# Altium schematic sheet 18 I2S.SchDoc
size 420 x 297 mm; Address1: Address1; Address2: Address2; Address3: Address3; Address4: Address4; DocumentNumber: АБВГ.123456.001 Э3; SheetNumber: 18; SheetTotal: 23; Scale: 1:1; DocumentType: Схема электрическая принципиальная; FirstReferrence: АБВГ.123456.001
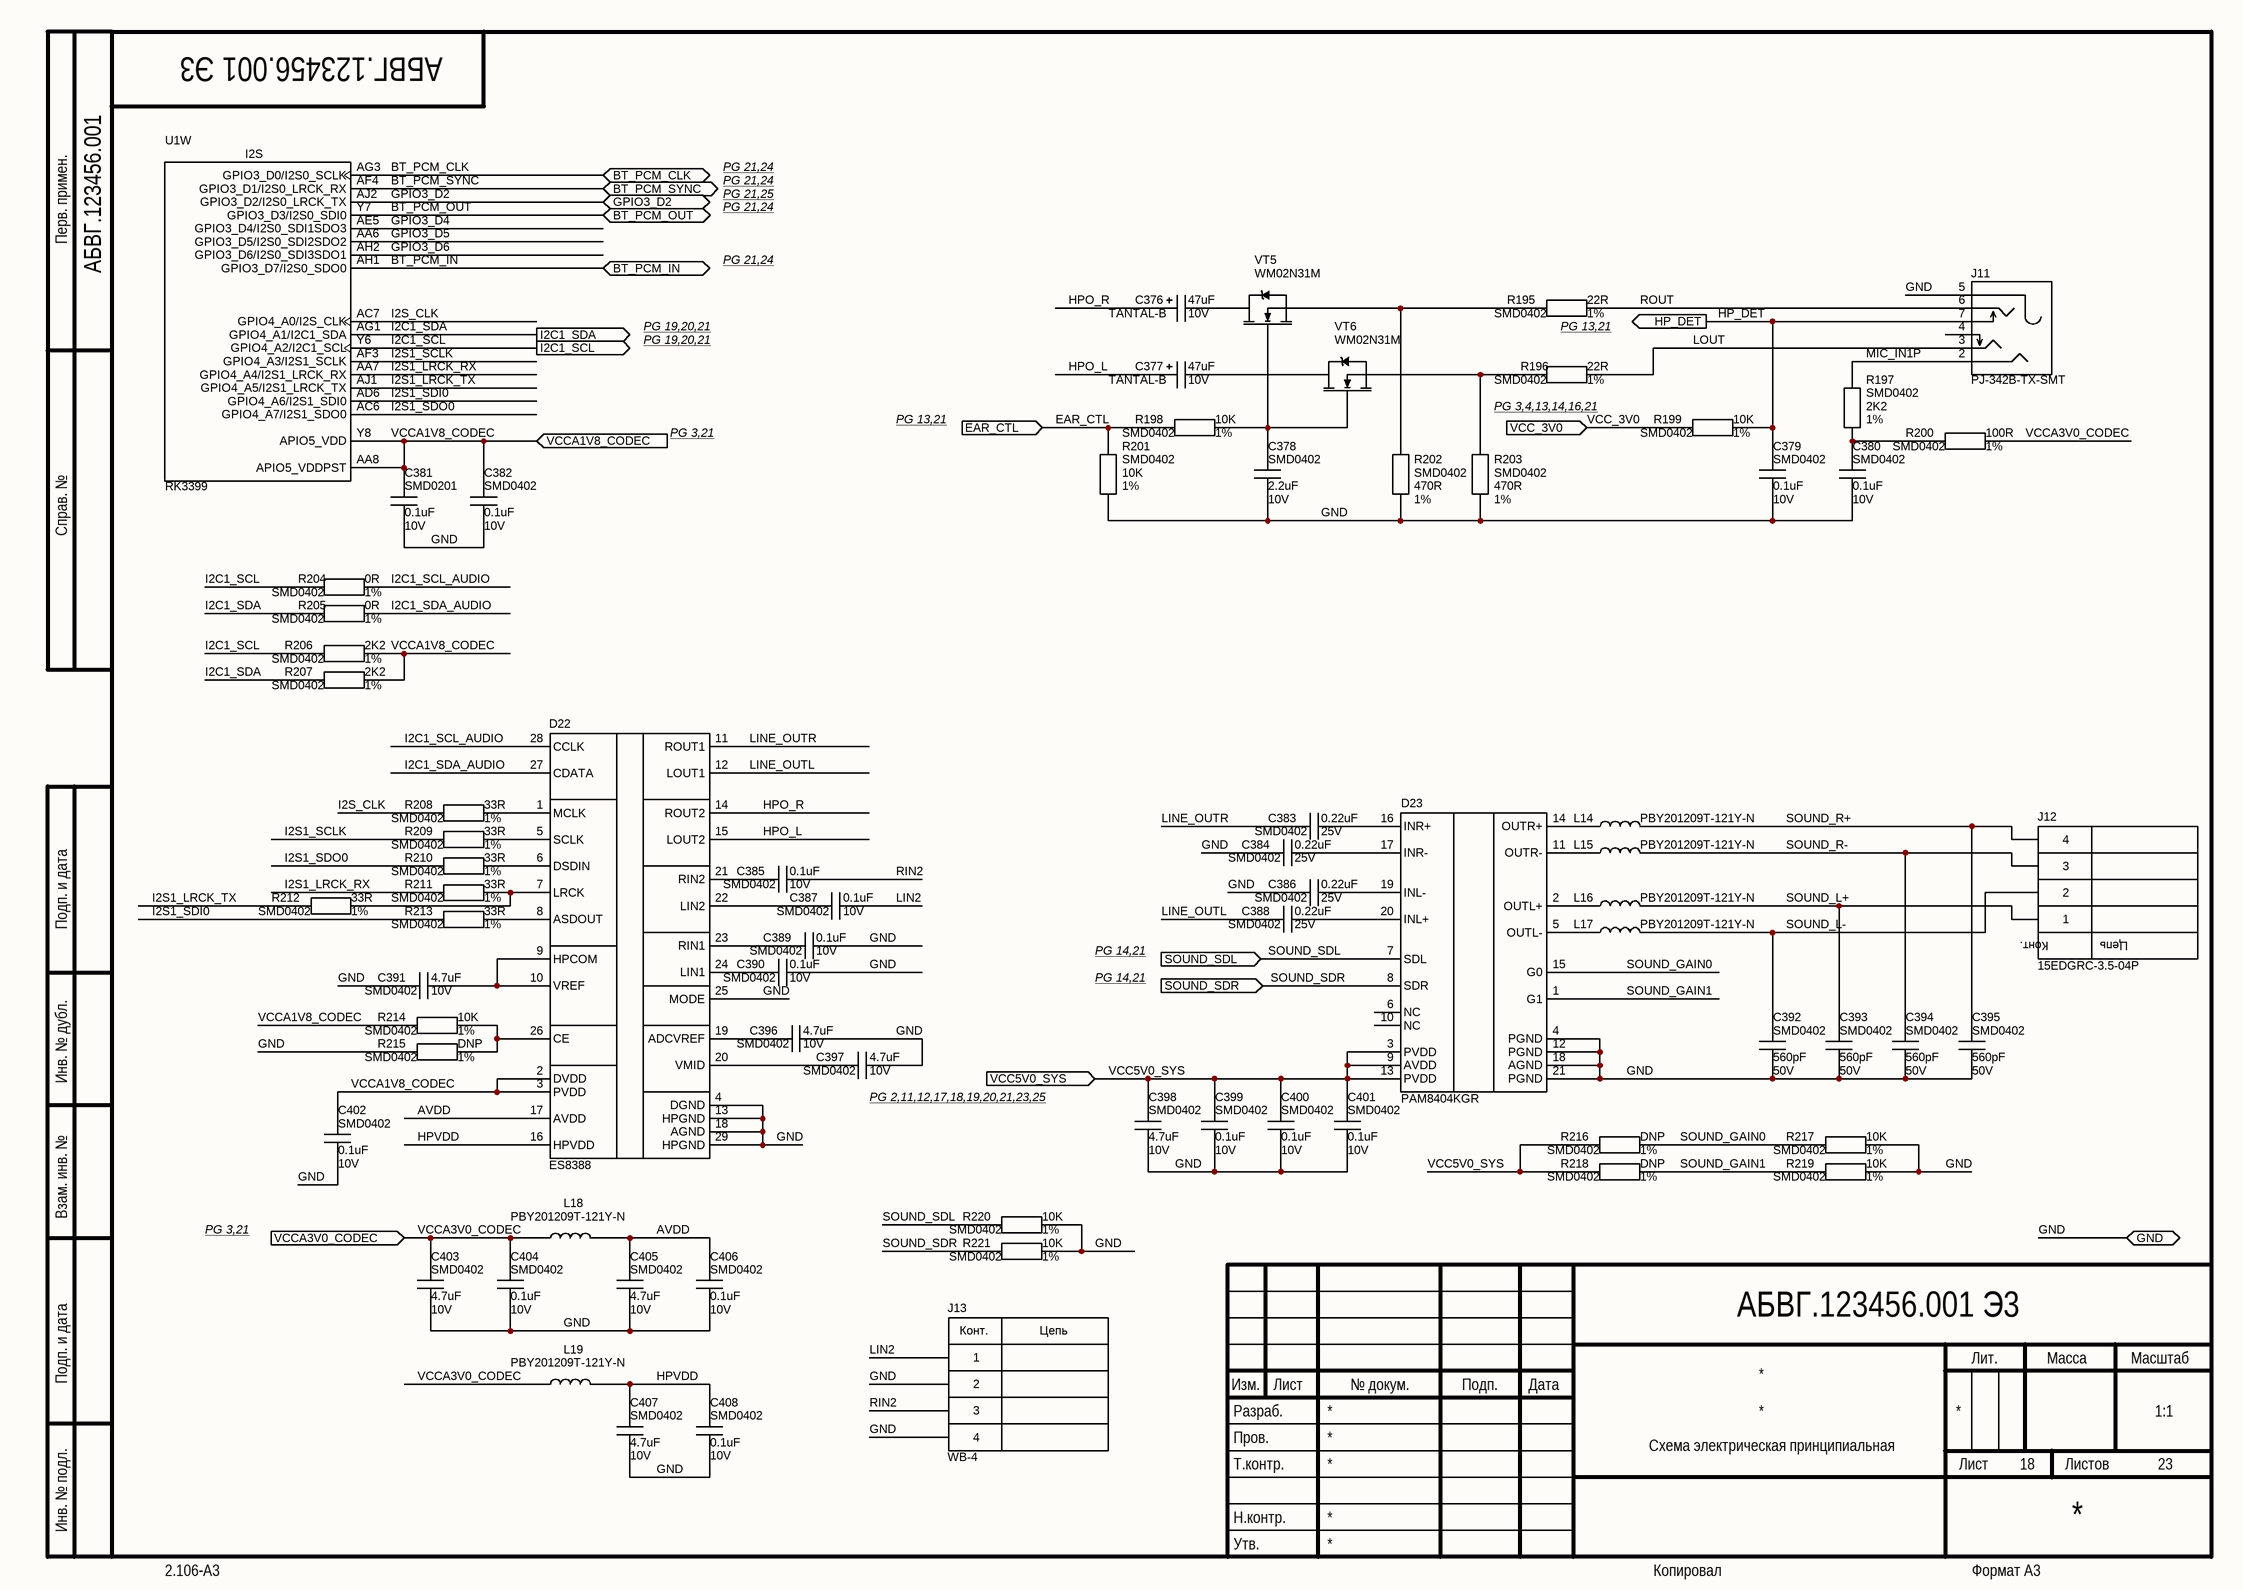
[diagram p0: 18 I2S.SchDoc]

## Parts
C376  Voltage: 10V  [TANTAL-B]  (hidden comment: 47uF)
C377  Voltage: 10V  [TANTAL-B]  (hidden comment: 47uF)
C378  Package: SMD0402  Voltage: 10V  [CAP_SMD_0402]  (hidden comment: 2.2uF)
C379  Package: SMD0402  Voltage: 10V  [CAP_SMD_0402]  (hidden comment: 0.1uF)
C380  Package: SMD0402  Voltage: 10V  [CAP_SMD_0402]  (hidden comment: 0.1uF)
C381  Package: SMD0201  Voltage: 10V  [CAP_SMD_0201]  (hidden comment: 0.1uF)
C382  Package: SMD0402  Voltage: 10V  [CAP_SMD_0402]  (hidden comment: 0.1uF)
C383  Package: SMD0402  Voltage: 25V  [CAP_SMD_0402]  (hidden comment: 0.22uF)
C384  Package: SMD0402  Voltage: 25V  [CAP_SMD_0402]  (hidden comment: 0.22uF)
C385  Package: SMD0402  Voltage: 10V  [CAP_SMD_0402]  (hidden comment: 0.1uF)
C386  Package: SMD0402  Voltage: 25V  [CAP_SMD_0402]  (hidden comment: 0.22uF)
C387  Package: SMD0402  Voltage: 10V  [CAP_SMD_0402]  (hidden comment: 0.1uF)
C388  Package: SMD0402  Voltage: 25V  [CAP_SMD_0402]  (hidden comment: 0.22uF)
C389  Package: SMD0402  Voltage: 10V  [CAP_SMD_0402]  (hidden comment: 0.1uF)
C390  Package: SMD0402  Voltage: 10V  [CAP_SMD_0402]  (hidden comment: 0.1uF)
C391  Package: SMD0402  Voltage: 10V  [CAP_SMD_0402]  (hidden comment: 4.7uF)
C392  Package: SMD0402  Voltage: 50V  [CAP_SMD_0402]  (hidden comment: 560pF)
C393  Package: SMD0402  Voltage: 50V  [CAP_SMD_0402]  (hidden comment: 560pF)
C394  Package: SMD0402  Voltage: 50V  [CAP_SMD_0402]  (hidden comment: 560pF)
C395  Package: SMD0402  Voltage: 50V  [CAP_SMD_0402]  (hidden comment: 560pF)
C396  Package: SMD0402  Voltage: 10V  [CAP_SMD_0402]  (hidden comment: 4.7uF)
C397  Package: SMD0402  Voltage: 10V  [CAP_SMD_0402]  (hidden comment: 4.7uF)
C398  Package: SMD0402  Voltage: 10V  [CAP_SMD_0402]  (hidden comment: 4.7uF)
C399  Package: SMD0402  Voltage: 10V  [CAP_SMD_0402]  (hidden comment: 0.1uF)
C400  Package: SMD0402  Voltage: 10V  [CAP_SMD_0402]  (hidden comment: 0.1uF)
C401  Package: SMD0402  Voltage: 10V  [CAP_SMD_0402]  (hidden comment: 0.1uF)
C402  Package: SMD0402  Voltage: 10V  [CAP_SMD_0402]  (hidden comment: 0.1uF)
C403  Package: SMD0402  Voltage: 10V  [CAP_SMD_0402]  (hidden comment: 4.7uF)
C404  Package: SMD0402  Voltage: 10V  [CAP_SMD_0402]  (hidden comment: 0.1uF)
C405  Package: SMD0402  Voltage: 10V  [CAP_SMD_0402]  (hidden comment: 4.7uF)
C406  Package: SMD0402  Voltage: 10V  [CAP_SMD_0402]  (hidden comment: 0.1uF)
C407  Package: SMD0402  Voltage: 10V  [CAP_SMD_0402]  (hidden comment: 4.7uF)
C408  Package: SMD0402  Voltage: 10V  [CAP_SMD_0402]  (hidden comment: 0.1uF)
D22  ES8388  [QFN-28 4mmx4mm]
D23  PAM8404KGR  [QFN-20 4mmx4mm]
J11  PJ-342B-TX-SMT  [PJ-342B-TX-SMT]
J12  15EDGRC-3.5-04P  [15EDGRC-3.5-04P]
J13  WB-4  [WB-4]
L14  value PBY201209T-121Y-N  [IND_SMD_0805]  (hidden comment: Value)
L15  value PBY201209T-121Y-N  [IND_SMD_0805]  (hidden comment: Value)
L16  value PBY201209T-121Y-N  [IND_SMD_0805]  (hidden comment: Value)
L17  value PBY201209T-121Y-N  [IND_SMD_0805]  (hidden comment: Value)
L18  value PBY201209T-121Y-N  [IND_SMD_0805]  (hidden comment: Value)
L19  value PBY201209T-121Y-N  [IND_SMD_0805]  (hidden comment: Value)
R195  Package: SMD0402  Tolerance: 1%  [RES_SMD_0402]  (hidden comment: 22R)
R196  Package: SMD0402  Tolerance: 1%  [RES_SMD_0402]  (hidden comment: 22R)
R197  Package: SMD0402  Tolerance: 1%  [RES_SMD_0402]  (hidden comment: 2K2)
R198  Package: SMD0402  Tolerance: 1%  [RES_SMD_0402]  (hidden comment: 10K)
R199  Package: SMD0402  Tolerance: 1%  [RES_SMD_0402]  (hidden comment: 10K)
R200  Package: SMD0402  Tolerance: 1%  [RES_SMD_0402]  (hidden comment: 100R)
R201  Package: SMD0402  Tolerance: 1%  [RES_SMD_0402]  (hidden comment: 10K)
R202  Package: SMD0402  Tolerance: 1%  [RES_SMD_0402]  (hidden comment: 470R)
R203  Package: SMD0402  Tolerance: 1%  [RES_SMD_0402]  (hidden comment: 470R)
R204  Package: SMD0402  Tolerance: 1%  [RES_SMD_0402]  (hidden comment: 0R)
R205  Package: SMD0402  Tolerance: 1%  [RES_SMD_0402]  (hidden comment: 0R)
R206  Package: SMD0402  Tolerance: 1%  [RES_SMD_0402]  (hidden comment: 2K2)
R207  Package: SMD0402  Tolerance: 1%  [RES_SMD_0402]  (hidden comment: 2K2)
R208  Package: SMD0402  Tolerance: 1%  [RES_SMD_0402]  (hidden comment: 33R)
R209  Package: SMD0402  Tolerance: 1%  [RES_SMD_0402]  (hidden comment: 33R)
R210  Package: SMD0402  Tolerance: 1%  [RES_SMD_0402]  (hidden comment: 33R)
R211  Package: SMD0402  Tolerance: 1%  [RES_SMD_0402]  (hidden comment: 33R)
R212  Package: SMD0402  Tolerance: 1%  [RES_SMD_0402]  (hidden comment: 33R)
R213  Package: SMD0402  Tolerance: 1%  [RES_SMD_0402]  (hidden comment: 33R)
R214  Package: SMD0402  Tolerance: 1%  [RES_SMD_0402]  (hidden comment: 10K)
R215  Package: SMD0402  Tolerance: 1%  [RES_SMD_0402]  (hidden comment: DNP)
R216  Package: SMD0402  Tolerance: 1%  [RES_SMD_0402]  (hidden comment: DNP)
R217  Package: SMD0402  Tolerance: 1%  [RES_SMD_0402]  (hidden comment: 10K)
R218  Package: SMD0402  Tolerance: 1%  [RES_SMD_0402]  (hidden comment: DNP)
R219  Package: SMD0402  Tolerance: 1%  [RES_SMD_0402]  (hidden comment: 10K)
R220  Package: SMD0402  Tolerance: 1%  [RES_SMD_0402]  (hidden comment: 10K)
R221  Package: SMD0402  Tolerance: 1%  [RES_SMD_0402]  (hidden comment: 10K)
U1  value RK3399  [BGA828C65P31X31_2100X2100X161N]  (hidden comment: RK3399_FF)  (part W of 23)
VT5  value WM02N31M  [SOT23]  (hidden comment: Value)
VT6  value WM02N31M  [SOT23]  (hidden comment: Value)

## Ports
BT_PCM_CLK (bidir), BT_PCM_IN (bidir), BT_PCM_OUT (bidir), BT_PCM_SYNC (bidir), EAR_CTL (in), GND (bidir), GPIO3_D2 (bidir), HP_DET (out), I2C1_SCL (out), I2C1_SDA (out), SOUND_SDL (in), SOUND_SDR (in), VCC5V0_SYS (in), VCC_3V0 (in), VCCA1V8_CODEC (in), VCCA3V0_CODEC (in)

## Nets
AVDD: C405.2 C406.1 D22.17(AVDD) L18.1
BT_PCM_CLK: U1.AG3(GPIO3_D0/I2S0_SCLK) ; port BT_PCM_CLK
BT_PCM_IN: U1.AH1(GPIO3_D7/I2S0_SDO0) ; port BT_PCM_IN
BT_PCM_OUT: U1.Y7(GPIO3_D3/I2S0_SDI0) ; port BT_PCM_OUT
BT_PCM_SYNC: U1.AF4(GPIO3_D1/I2S0_LRCK_RX) ; port BT_PCM_SYNC
EAR_CTL: R198.2 R201.1 ; port EAR_CTL
GND: C378.1 C379.2 C380.2 C381.2 C382.2 C384.2 C386.2 C389.2 C390.2 C391.1 C392.2 C393.2 C394.2 C395.2 C396.2 C397.2 C398.1 C399.2 C400.2 C401.2 C402.2 C403.1 C404.2 C405.1 C406.2 C407.1 C408.2 D22.4(DGND) D22.13(HPGND) D22.18(AGND) D22.25(MODE) D22.29(HPGND) D23.4(PGND) D23.12(PGND) D23.18(AGND) D23.21(PGND) J11.5 J13.2 J13.4 R201.2 R202.1 R203.1 R215.1 R217.1 R219.1 R220.1 R221.1 ; port GND
GPIO3_D2: U1.AJ2(GPIO3_D2/I2S0_LRCK_TX) ; port GPIO3_D2
GPIO3_D4: U1.AE5(GPIO3_D4/I2S0_SDI1SDO3)
GPIO3_D5: U1.AA6(GPIO3_D5/I2S0_SDI2SDO2)
GPIO3_D6: U1.AH2(GPIO3_D6/I2S0_SDI3SDO1)
HP_DET: C379.1 J11.7 R199.1 ; port HP_DET
HPO_L: C377.1 D22.15(LOUT2)
HPO_R: C376.1 D22.14(ROUT2)
HPVDD: C407.2 C408.1 D22.16(HPVDD) L19.1
I2C1_SCL: R204.1 R206.2 U1.Y6(GPIO4_A2/I2C1_SCL) ; port I2C1_SCL
I2C1_SCL_AUDIO: D22.28(CCLK) R204.2
I2C1_SDA: R205.1 R207.2 U1.AG1(GPIO4_A1/I2C1_SDA) ; port I2C1_SDA
I2C1_SDA_AUDIO: D22.27(CDATA) R205.2
I2S1_LRCK_RX: R211.1 U1.AA7(GPIO4_A4/I2S1_LRCK_RX)
I2S1_LRCK_TX: R212.1 U1.AJ1(GPIO4_A5/I2S1_LRCK_TX)
I2S1_SCLK: R209.1 U1.AF3(GPIO4_A3/I2S1_SCLK)
I2S1_SDI0: R213.1 U1.AD6(GPIO4_A6/I2S1_SDI0)
I2S1_SDO0: R210.1 U1.AC6(GPIO4_A7/I2S1_SDO0)
I2S_CLK: R208.1 U1.AC7(GPIO4_A0/I2S_CLK)
LIN2: C387.2 J13.1
LINE_OUTL: C388.2 D22.12(LOUT1)
LINE_OUTR: C383.2 D22.11(ROUT1)
LOUT: J11.3 R196.1
MIC_IN1P: J11.2 R197.2
RIN2: C385.2 J13.3
ROUT: J11.6 R195.1
SOUND_GAIN0: D23.15(G0) R216.2 R217.2
SOUND_GAIN1: D23.1(G1) R218.2 R219.2
SOUND_L+: C393.1 J12.1 L16.1
SOUND_L-: C392.1 J12.2 L17.1
SOUND_R+: C395.1 J12.4 L14.1
SOUND_R-: C394.1 J12.3 L15.1
SOUND_SDL: D23.7(SDL) R220.2 ; port SOUND_SDL
SOUND_SDR: D23.8(SDR) R221.2 ; port SOUND_SDR
VCC5V0_SYS: C398.2 C399.1 C400.1 C401.1 D23.3(PVDD) D23.9(AVDD) D23.13(PVDD) R216.1 R218.1 ; port VCC5V0_SYS
VCC_3V0: R199.2 ; port VCC_3V0
VCCA1V8_CODEC: C381.1 C382.1 C402.1 D22.2(DVDD) D22.3(PVDD) R206.1 R207.1 R214.2 U1.AA8(APIO5_VDDPST) U1.Y8(APIO5_VDD) ; port VCCA1V8_CODEC
VCCA3V0_CODEC: C403.2 C404.1 L18.2 L19.2 R200.2 ; port VCCA3V0_CODEC
NetC376_2: C376.2 VT5.3(D)
NetC377_2: C377.2 VT6.3(D)
NetC378_2: C378.2 R198.1 VT5.1(G) VT6.1(G)
NetC380_1: C380.1 R197.1 R200.1
NetC383_1: C383.1 D23.16(INR+)
NetC384_1: C384.1 D23.17(INR-)
NetC385_1: C385.1 D22.21(RIN2)
NetC386_1: C386.1 D23.19(INL-)
NetC387_1: C387.1 D22.22(LIN2)
NetC388_1: C388.1 D23.20(INL+)
NetC389_1: C389.1 D22.23(RIN1)
NetC390_1: C390.1 D22.24(LIN1)
NetC391_2: C391.2 D22.9(HPCOM) D22.10(VREF)
NetC396_1: C396.1 D22.19(ADCVREF)
NetC397_1: C397.1 D22.20(VMID)
NetD22_1: D22.1(MCLK) R208.2
NetD22_5: D22.5(SCLK) R209.2
NetD22_6: D22.6(DSDIN) R210.2
NetD22_7: D22.7(LRCK) R211.2 R212.2
NetD22_8: D22.8(ASDOUT) R213.2
NetD22_26: D22.26(CE) R214.1 R215.2
NetD23_2: D23.2(OUTL+) L16.2
NetD23_5: D23.5(OUTL-) L17.2
NetD23_11: D23.11(OUTR-) L15.2
NetD23_14: D23.14(OUTR+) L14.2
NetR195_2: R195.2 R202.2 VT5.2(S)
NetR196_2: R196.2 R203.2 VT6.2(S)

Not connected (* = marked no-connect by the designer): D23 6(NC) 10(NC); J11 4

## Notes on the sheet
- PG 21,24
- Перв. примен.
- PG 21,25
- PG 19,20,21
- (near R195) PG 13,21
- PG 3,21
- PG 13,21
- PG 3,4,13,14,16,21
- Справ. №
- Подп. и дата
- PG 14,21
- Инв. № дубл.
- (near C397) PG 2,11,12,17,18,19,20,21,23,25
- Взам. инв. №
- Разраб.
- Изм.
- Лист
- № докум.
- Подп.
- Дата
- Лит.
- Масса
- Масштаб
- Пров.
- Т.контр.
- Листов
- Инв. № подл.
- Утв.
- Н.контр.
- 2.106-A3
- Копировал
- Формат А3
- (in symbol CON4) Конт.; Цепь
- (in symbol RK3399_FF, part W) I2S

## Library data of the parts
C376 C377 = Tantal: PartNumber: CA45L-B010K476TE500; Tolerance: 20%; Manufacturer: *; ComponentType: SMD Tantalum Chip Capacitor; ClassName: *; Package: TANTAL-B; Value: 47uF
C378 = Ceramic_Cap: PartNumber: CC0402KRX5R6BB225; ComponentType: SMD Ceramic Chip Capacitor; Manufacter: *; Tolerance: *; ClassName: *; Value: 2.2uF
C379 C380 C382 C385 C387 C389 C390 C399-C402 C404 C406 C408 = Ceramic_Cap: PartNumber: CC0402KRX5R6BB104; ComponentType: SMD Ceramic Chip Capacitor; Manufacter: *; Tolerance: *; ClassName: *; Value: 0.1uF
C381 = Ceramic_Cap: PartNumber: CC0201KRX5R6BB104; ComponentType: SMD Ceramic Chip Capacitor; Manufacter: *; Tolerance: *; ClassName: *; Value: 0.1uF
C383 C384 C386 C388 = Ceramic_Cap: PartNumber: CC0402KRX5R8BB224; ComponentType: SMD Ceramic Chip Capacitor; Manufacter: *; Tolerance: *; ClassName: *; Value: 0.22uF
C391 C396-C398 C403 C405 C407 = Ceramic_Cap: PartNumber: CL05A475KP5NRNC; ComponentType: SMD Ceramic Chip Capacitor; Manufacter: *; Tolerance: *; ClassName: *; Value: 4.7uF
C392-C395 = Ceramic_Cap: PartNumber: CC0402JRX7R9BB561; ComponentType: SMD Ceramic Chip Capacitor; Manufacter: *; Tolerance: *; ClassName: *; Value: 560pF
J12 = CON4: Manufacter: *; Package: 15EDGRC-3.5-04P; PartNumber: 15EDGRC-3.5-04P; ClassName: *; Value: 15EDGRC-3.5-04P
J13 = CON4: PartNumber: DS1066-04M(MW-4M); Manufacter: *; Package: WB-4; ClassName: *; Value: WB-4
L14-L19 = Inductor_smal: ComponentType: *; Manufacter: *; Package: SMD0805; PartNumber: PBY201209T-121Y-N; ClassName: *
R195 R196 = Chip_Res: PartNumber: RC0402FR-0722RL; ComponentType: SMD Chip Resistor; Manufacter: *; Voltage: *; ClassName: *; Value: 22R
R197 R206 R207 = Chip_Res: PartNumber: RC0402FR-072K2L; ComponentType: SMD Chip Resistor; Manufacter: *; Voltage: *; ClassName: *; Value: 2K2
R198 R199 R201 R214 R217 R219-R221 = Chip_Res: PartNumber: RC0402FR-0710KL; ComponentType: SMD Chip Resistor; Manufacter: *; Voltage: *; ClassName: *; Value: 10K
R200 = Chip_Res: PartNumber: RC0402FR-07100RL; ComponentType: SMD Chip Resistor; Manufacter: *; Voltage: *; ClassName: *; Value: 100R
R202 R203 = Chip_Res: PartNumber: RC0402FR-07470RL; ComponentType: SMD Chip Resistor; Manufacter: *; Voltage: *; ClassName: *; Value: 470R
R204 R205 = Chip_Res: PartNumber: RC0402FR-070RL; ComponentType: SMD Chip Resistor; Manufacter: *; Voltage: *; ClassName: *; Value: 0R
R208-R213 = Chip_Res: PartNumber: RC0402FR-0733RL; ComponentType: SMD Chip Resistor; Manufacter: *; Voltage: *; ClassName: *; Value: 33R
R215 R216 R218 = Chip_Res: PartNumber: Do Not Place; ComponentType: SMD Chip Resistor; Manufacter: *; Voltage: *; ClassName: *; Value: DNP
VT5 VT6 = MOSFET_N: ComponentType: *; Manufacter: *; Package: SOT23; PartNumber: WM02N31M; ClassName: *
D22 = ES8388: ComponentType: SMD Chip Resistor; Manufacter: *; Voltage: *; ClassName: *; Tolerance: *; PartNumber: ES8388; Package: QFN-28; Value: ES8388
D23 = PAM8404KGR: ComponentType: SMD Chip Resistor; Manufacter: *; Voltage: *; ClassName: *; Tolerance: *; PartNumber: PAM8404KGR; Package: QFN-20; Value: PAM8404KGR
J11 = PJ-342B-TX-SMT: ComponentType: SMD Chip Resistor; Manufacter: *; Voltage: *; ClassName: *; Tolerance: *; PartNumber: PJ-342B-TX-SMT; Package: PJ-342B-TX-SMT; Value: PJ-342B-TX-SMT
U1 = RK3399_FF: Package: BGA828; ComponentType: *; Manufacter: *; PartNumber: RK3399; ClassName: *